# EAGLE design PracticalArduino_ProtoShield_v2_0_mega (EAGLE 5.06)
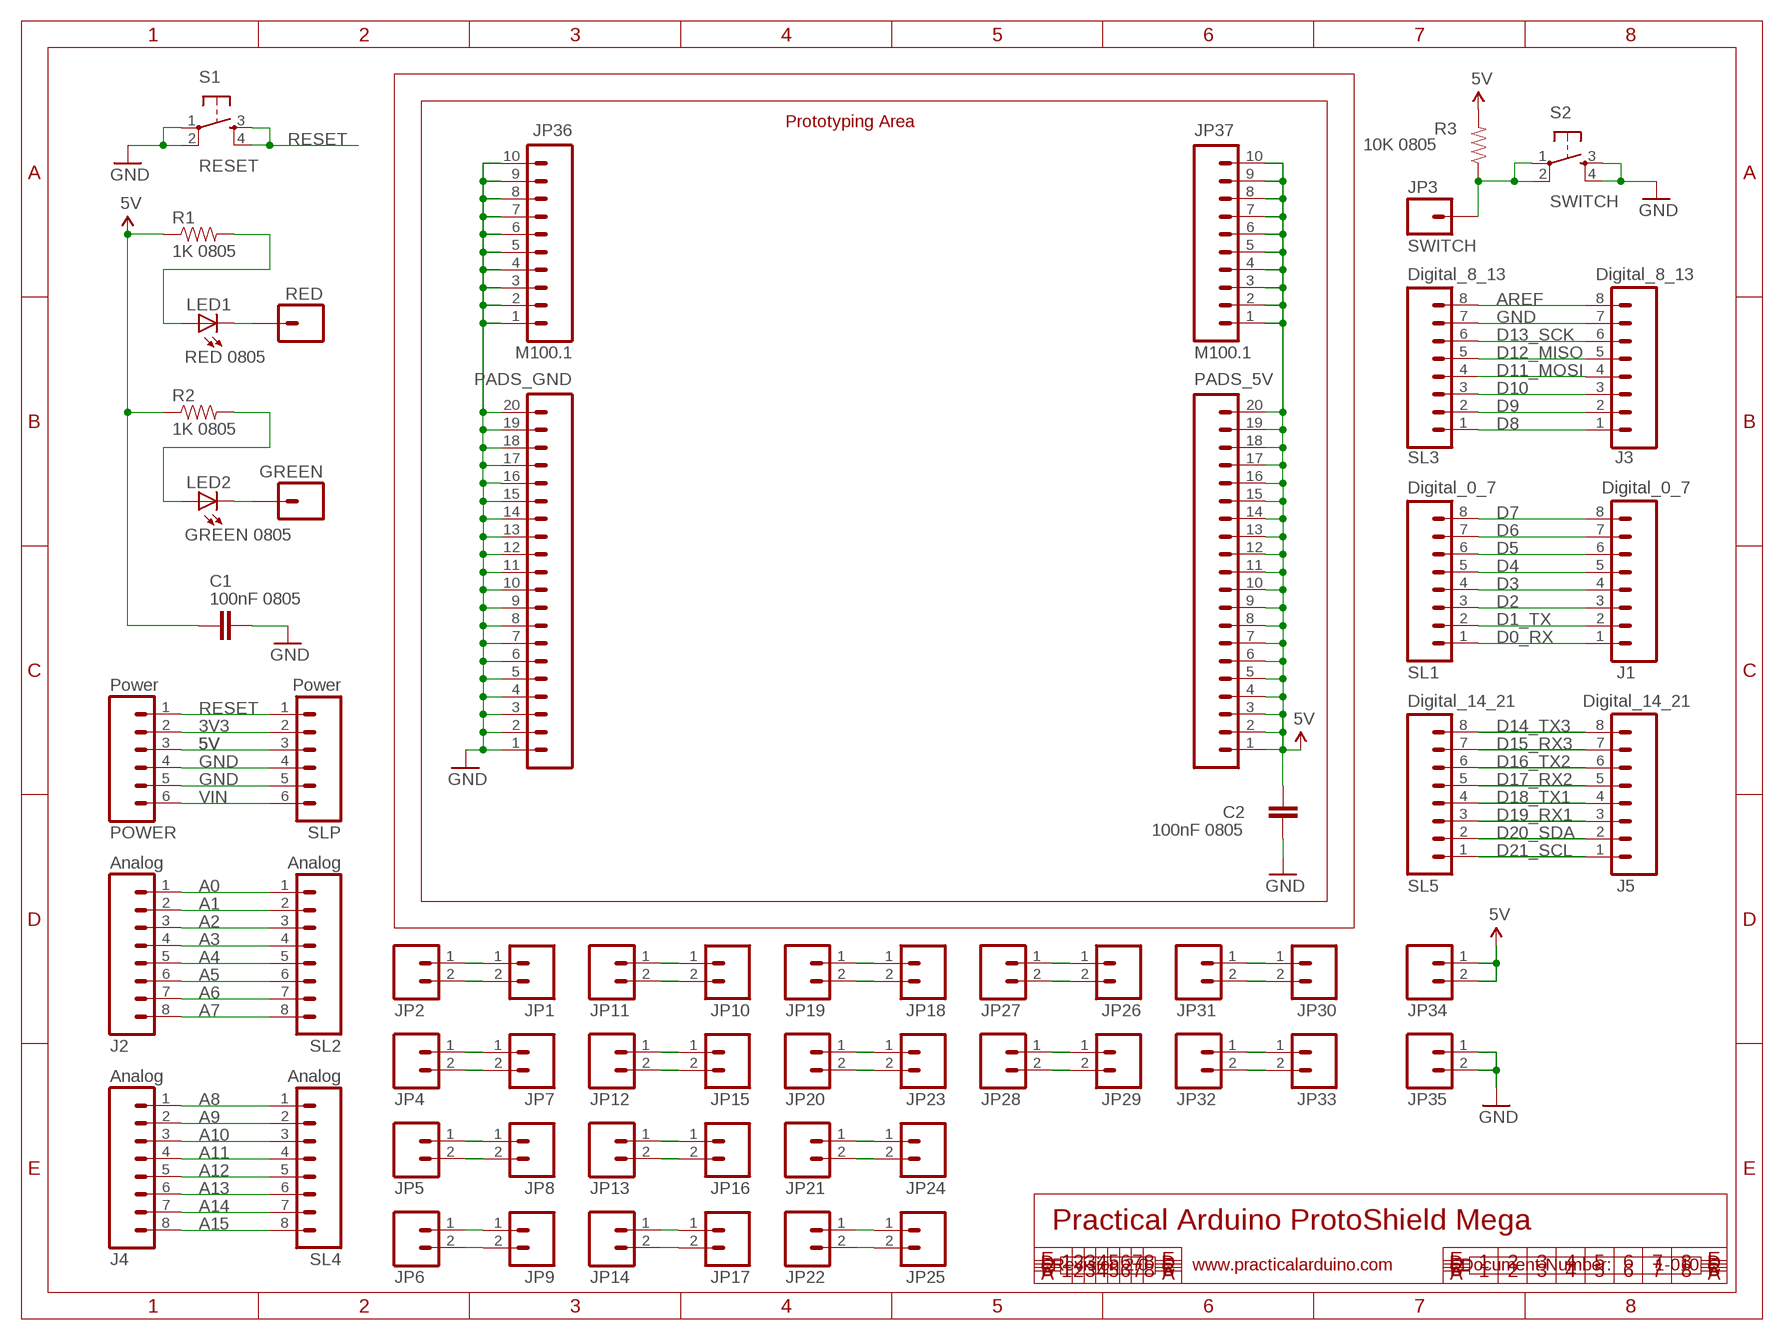
[diagram p0: schematic, sheet 1]

## Parts
C1  100nF 0805  CAP0805-LARGE  [0805-LARGE]
C2  100nF 0805  CAP0805-LARGE  [0805-LARGE]
GREEN  M01PTH  [1X01]
J1  Digital_0_7  M08  [1X08]
J2  Analog  M08  [1X08]
J3  Digital_8_13  M08  [1X08]
J4  Analog  M08  [1X08]
J5  Digital_14_21  M08  [1X08]
JP1  M02PTH  [1X02]
JP2  M02PTH  [1X02]
JP3  SWITCH  M01PTH  [1X01]
JP4  M02PTH  [1X02]
JP5  M02PTH  [1X02]
JP6  M02PTH  [1X02]
JP7  M02PTH  [1X02]
JP8  M02PTH  [1X02]
JP9  M02PTH  [1X02]
JP10  M02PTH  [1X02]
JP11  M02PTH  [1X02]
JP12  M02PTH  [1X02]
JP13  M02PTH  [1X02]
JP14  M02PTH  [1X02]
JP15  M02PTH  [1X02]
JP16  M02PTH  [1X02]
JP17  M02PTH  [1X02]
JP18  M02PTH  [1X02]
JP19  M02PTH  [1X02]
JP20  M02PTH  [1X02]
JP21  M02PTH  [1X02]
JP22  M02PTH  [1X02]
JP23  M02PTH  [1X02]
JP24  M02PTH  [1X02]
JP25  M02PTH  [1X02]
JP26  M02PTH  [1X02]
JP27  M02PTH  [1X02]
JP28  M02PTH  [1X02]
JP29  M02PTH  [1X02]
JP30  M02PTH  [1X02]
JP31  M02PTH  [1X02]
JP32  M02PTH  [1X02]
JP33  M02PTH  [1X02]
JP34  M02PTH  [1X02]
JP35  M02PTH  [1X02]
JP36  M100.1  [1X10]
JP37  M100.1  [1X10]
LED1  RED 0805  LED0805-LARGE  [LED-0805-LARGE]
LED2  GREEN 0805  LED0805-LARGE  [LED-0805-LARGE]
PADS_5V  M20  [1X20]
PADS_GND  M20  [1X20]
POWER  Power  M06SIP  [1X06]
R1  1K 0805  RESISTOR0805-LARGE  [0805-LARGE]
R2  1K 0805  RESISTOR0805-LARGE  [0805-LARGE]
R3  10K 0805  RESISTOR0805-LARGE  [0805-LARGE]
RED  M01PTH  [1X01]
S1  RESET  TAC_SWITCHPTH  [TACTILE-PTH]
S2  SWITCH  TAC_SWITCHPTH  [TACTILE-PTH]
SL1  Digital_0_7  M08  [1X08]
SL2  Analog  M08  [1X08]
SL3  Digital_8_13  M08  [1X08]
SL4  Analog  M08  [1X08]
SL5  Digital_14_21  M08  [1X08]
SLP  Power  M06SIP  [1X06]

## Nets
3V3: POWER.2 SLP.2
5V: C1.1 C2.1 JP34.1 JP34.2 JP37.1 JP37.2 JP37.3 JP37.4 JP37.5 JP37.6 JP37.7 JP37.8 JP37.9 JP37.10 PADS_5V.1 PADS_5V.2 PADS_5V.3 PADS_5V.4 PADS_5V.5 PADS_5V.6 PADS_5V.7 PADS_5V.8 PADS_5V.9 PADS_5V.10 PADS_5V.11 PADS_5V.12 PADS_5V.13 PADS_5V.14 PADS_5V.15 PADS_5V.16 PADS_5V.17 PADS_5V.18 PADS_5V.19 PADS_5V.20 POWER.3 R1.1 R2.1 R3.2 SLP.3
A0: J2.1 SL2.1
A1: J2.2 SL2.2
A2: J2.3 SL2.3
A3: J2.4 SL2.4
A4: J2.5 SL2.5
A5: J2.6 SL2.6
A6: J2.7 SL2.7
A7: J2.8 SL2.8
A8: J4.1 SL4.1
A9: J4.2 SL4.2
A10: J4.3 SL4.3
A11: J4.4 SL4.4
A12: J4.5 SL4.5
A13: J4.6 SL4.6
A14: J4.7 SL4.7
A15: J4.8 SL4.8
AREF: J3.8 SL3.8
D0_RX: J1.1 SL1.1
D1: JP10.2 JP11.2
D1_TX: J1.2 SL1.2
D2: J1.3 SL1.3
D3: J1.4 SL1.4
D4: J1.5 SL1.5
D5: J1.6 SL1.6
D6: J1.7 SL1.7
D7: J1.8 SL1.8
D8: J3.1 SL3.1
D9: J3.2 SL3.2
D10: J3.3 SL3.3
D11: JP10.1 JP11.1
D11_MOSI: J3.4 SL3.4
D12: JP18.2 JP19.2
D12_MISO: J3.5 SL3.5
D13: JP18.1 JP19.1
D13_SCK: J3.6 SL3.6
D14: JP26.2 JP27.2
D14_TX3: J5.8 SL5.8
D15: JP26.1 JP27.1
D15_RX3: J5.7 SL5.7
D16: JP30.2 JP31.2
D16_TX2: J5.6 SL5.6
D17: JP30.1 JP31.1
D17_RX2: J5.5 SL5.5
D18_TX1: J5.4 SL5.4
D19_RX1: J5.3 SL5.3
D20_SDA: J5.2 SL5.2
D21_SCL: J5.1 SL5.1
D22: JP1.2 JP2.2
D23: JP1.1 JP2.1
GND: C1.2 C2.2 J3.7 JP35.1 JP35.2 JP36.1 JP36.2 JP36.3 JP36.4 JP36.5 JP36.6 JP36.7 JP36.8 JP36.9 JP36.10 PADS_GND.1 PADS_GND.2 PADS_GND.3 PADS_GND.4 PADS_GND.5 PADS_GND.6 PADS_GND.7 PADS_GND.8 PADS_GND.9 PADS_GND.10 PADS_GND.11 PADS_GND.12 PADS_GND.13 PADS_GND.14 PADS_GND.15 PADS_GND.16 PADS_GND.17 PADS_GND.18 PADS_GND.19 PADS_GND.20 POWER.4 POWER.5 S1.1 S1.2 S2.3 S2.4 SL3.7 SLP.4 SLP.5
N$1: LED1.A R1.2
N$2: LED1.C RED.1
N$3: LED2.A R2.2
N$4: GREEN.1 LED2.C
N$6: JP3.1 R3.1 S2.1 S2.2
N$337: JP4.1 JP7.1
N$338: JP4.2 JP7.2
N$339: JP5.1 JP8.1
N$340: JP5.2 JP8.2
N$341: JP6.1 JP9.1
N$342: JP6.2 JP9.2
N$343: JP12.1 JP15.1
N$344: JP12.2 JP15.2
N$345: JP13.1 JP16.1
N$346: JP13.2 JP16.2
N$347: JP14.1 JP17.1
N$348: JP14.2 JP17.2
N$349: JP20.1 JP23.1
N$350: JP20.2 JP23.2
N$351: JP21.1 JP24.1
N$352: JP21.2 JP24.2
N$353: JP22.1 JP25.1
N$354: JP22.2 JP25.2
N$355: JP28.1 JP29.1
N$356: JP28.2 JP29.2
N$357: JP32.1 JP33.1
N$358: JP32.2 JP33.2
RESET: POWER.1 S1.3 S1.4 SLP.1
VIN: POWER.6 SLP.6

## Notes on the sheet
- Prototyping Area
- Practical Arduino ProtoShield Mega
- Revision 2.0 | www.practicalarduino.com | Document Number: | 1-010

## Library data of the parts
C1 C2 = SparkFun:CAP: Capacitor Standard 0603 ceramic capacitor, and 0.1" leaded capacitor.
GREEN JP3 RED = SparkFun:M01: Header 1 Standard 1-pin 0.1" header. Use with straight break away headers (SKU : PRT-00116), right angle break away headers (PRT-00553), swiss pins (PRT-00743), machine pins (PRT-00117), and female headers (PRT-00115).
J1-J5 SL1-SL5 = SparkFun:M08: Header 8 Standard 8-pin 0.1" header. Use with straight break away headers (SKU : PRT-00116), right angle break away headers (PRT-00553), swiss pins (PRT-00743), machine pins (PRT-00117), and female headers (PRT-00115).
JP1 JP2 JP4-JP35 = SparkFun:M02: Header 2 Standard 2-pin 0.1" header. Use with straight break away headers (SKU : PRT-00116), right angle break away headers (PRT-00553), swiss pins (PRT-00743), machine pins (PRT-00117), and female headers (PRT-00115). Molex polarized connector foot print use with SKU : PRT-08233 with associated crimp pins and housings.
JP36 JP37 = SparkFun:M10: Header 10 Standard 10-pin 0.1" header. Use with straight break away headers (SKU : PRT-00116), right angle break away headers (PRT-00553), swiss pins (PRT-00743), machine pins (PRT-00117), and female headers (PRT-00115).
LED1 LED2 = SparkFun:LED: LEDs Standard schematic elements and footprints for 5mm, 3mm, 1206, and 0603 sized LEDs. 5mm - Spark Fun Electronics SKU : COM-00529 (and others)
PADS_5V PADS_GND = SparkFun:M20: This is just like the LOCK variant in that the holes are staggared by 5 mil, but except for the last two holes. They are not altered from the "standard" footprint layout. This is used for a special purpose on the layout of our Graphic LCD Backpack. Make sure you want to use this device before selecting it for you project!
POWER SLP = SparkFun:M06: Header 6 Standard 6-pin 0.1" header. Use with straight break away headers (SKU : PRT-00116), right angle break away headers (PRT-00553), swiss pins (PRT-00743), machine pins (PRT-00117), and female headers (PRT-00115). Molex polarized connector foot print use with SKU : PRT-08094 with associated crimp pins and housings. NOTES ON THE VARIANTS LOCK and LOCK_LONGPADS... This footprint was designed to help hold the alignment of a through-hole component (i.e. 6-pin header) while soldering it into place. You may notice that each hole has been shifted either up or down by 0.005 of an inch from it's more standard position (which is a perfectly straight line). This slight alteration caused the pins (the squares in the middle) to touch the edges of the holes. Because they are alternating, it causes a "brace" to hold the component in place. 0.005 has proven to be the perfect amount of "off-center" position when using our standard breakaway headers. Although looks a little odd when you look at the bare footprint, once you have a header in there, the alteration is very hard to notice. Also, if you push a header all the way into place, it is covered up entirely on the bottom side. This idea of altering the position of holes to aid alignment will be further integrated into the Sparkfun Library for other footprints. It can help hold any component with 3 or more connection pins.
R1-R3 = SparkFun:RESISTOR: Resistor Basic schematic elements and footprints for 0603, 1206, and PTH 1/10th watt (small) resistors.
S1 S2 = SparkFun:TAC_SWITCH: Momentary Switch Button commonly used for reset or general input. Spark Fun Electronics SKU : COM-00097

## Board
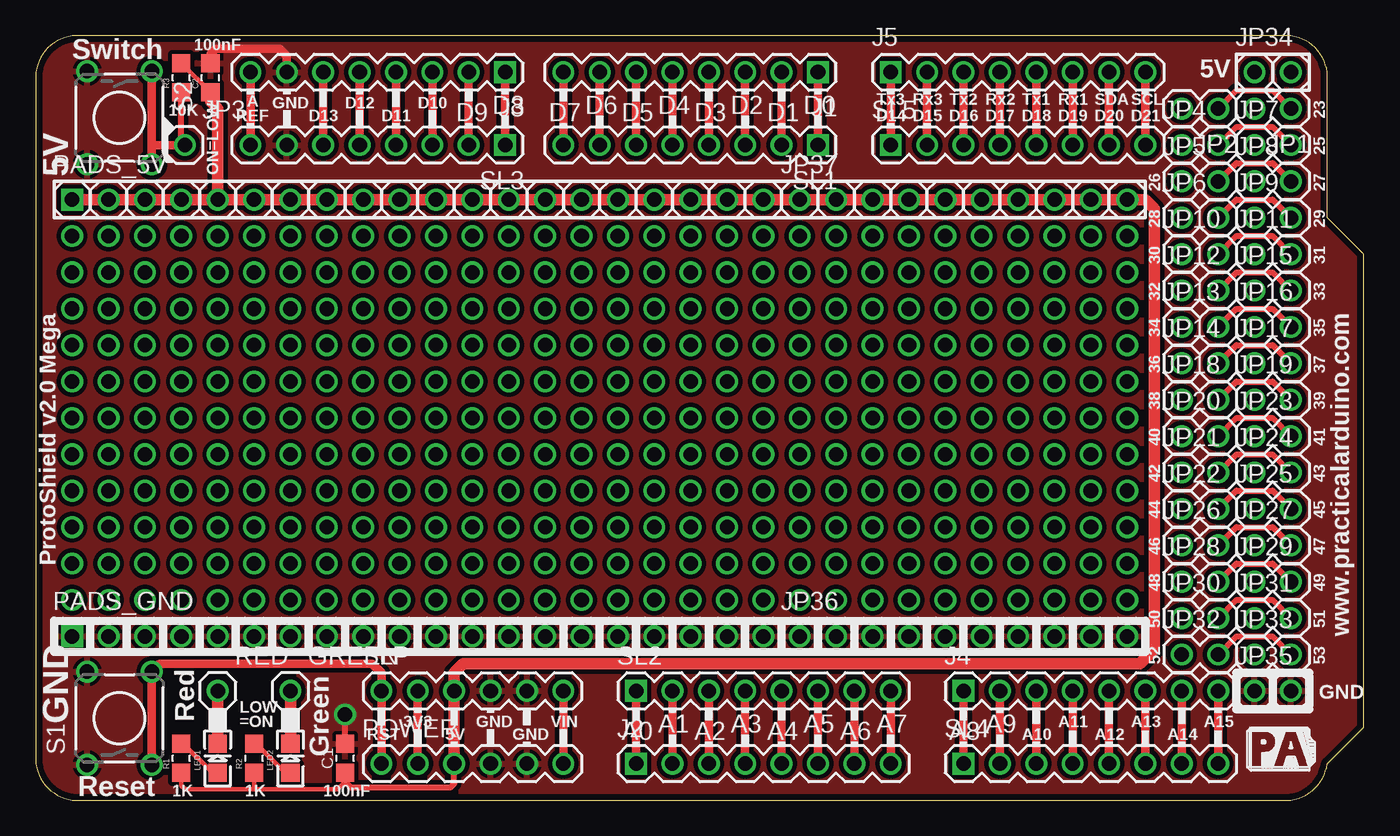
[diagram p1: board, top side]
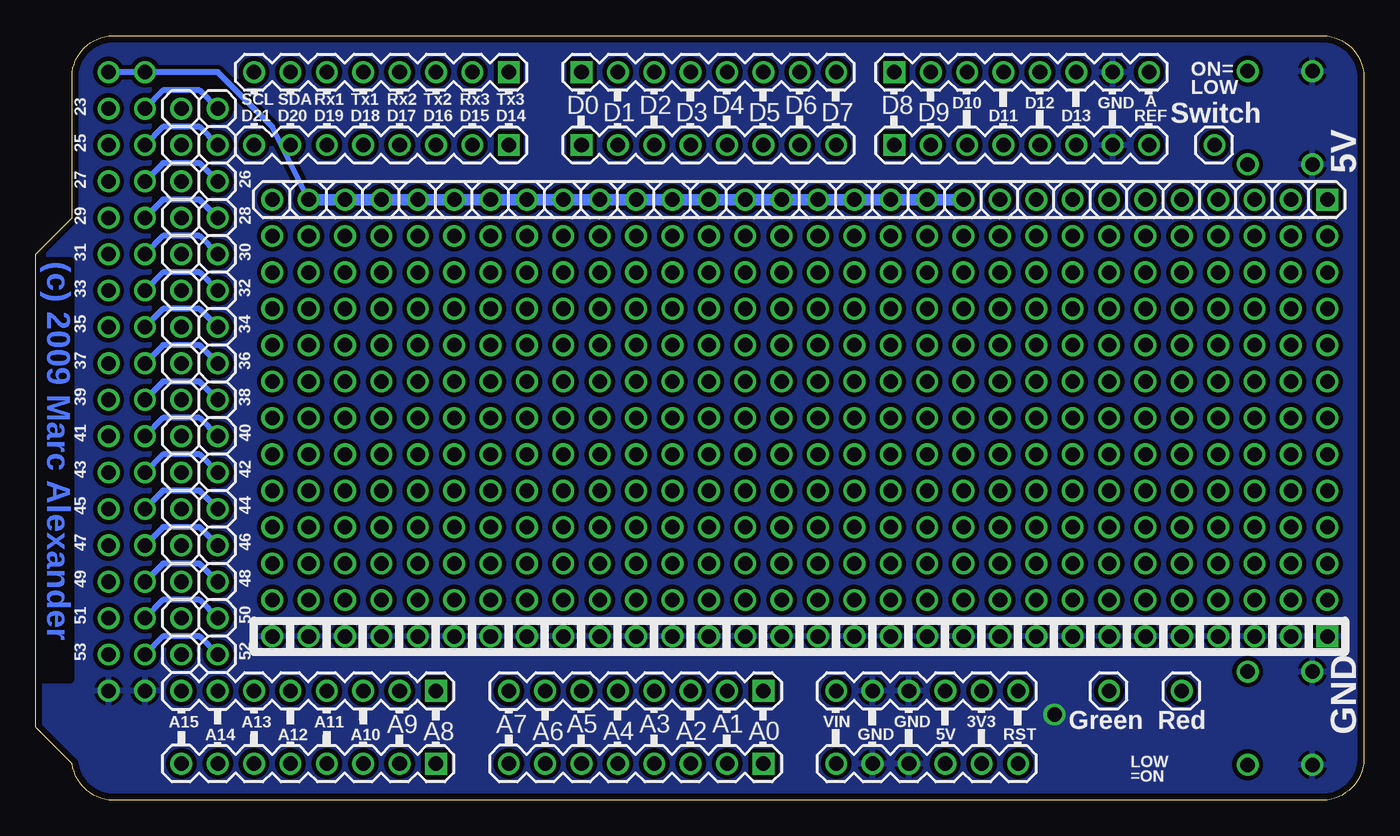
[diagram p2: board, bottom side, seen from below]

Size 92.71 x 53.34 mm. Coordinates in mm from the lower left corner, seen from the top.
Outline: 2.54,0 arc-74 0,2.54 0,50.8 arc-74 2.54,53.34 87.63,53.34 arc-74 90.17,50.8 90.17,40.64 92.71,38.1 92.71,5.08 90.17,2.54 arc-74 87.63,0
Outline: 2.54,0 87.63,0
Outline: 2.54,0 87.63,0
Copper layers (1*16): Top 0.035mm / dielectric 1.5mm / Bottom 0.035mm
Design rules "default *": minimum track width 10mil, minimum drill 24mil, track to track 12mil, track to pad 12mil, pad to pad 12mil, via to via 12mil, smd to smd 8mil, copper to edge 18mil, drill to drill 8mil, minimum pad ring 10mil, minimum via ring 8mil, stop-mask expansion 4mil, vias tented up to drill 0mil, thermal gap 10mil

### Footprints (pad centres in the part's own frame; a part is rotated, then mirrored left to right if it is on the bottom)
0805-LARGE = smd 1.27 x 1.27: 1 -1.016,0; 2 1.016,0
1X01 = drill 1.016 round: 1 0,0
1X08 = drill 1.016 square: 1 0,0 | drill 1.016 round: 2 2.54,0; 3 5.08,0; 4 7.62,0; 5 10.16,0; 6 12.7,0; 7 15.24,0; 8 17.78,0
1X02 = drill 1.016 round: 1 0,0; 2 2.54,0
1X10 = drill 1.016 round: 1 0,0; 2 2.54,0; 3 5.08,0; 4 7.62,0; 5 10.16,0; 6 12.7,0; 7 15.24,0; 8 17.78,0; 9 20.32,0; 10 22.86,0
LED-0805-LARGE = smd 1.27 x 1.27: A -1.016,0; C 1.016,0
1X20 = drill 1.016 square: 1 0,0 | drill 1.016 round: 2 2.54,0; 3 5.08,0; 4 7.62,0; 5 10.16,0; 6 12.7,0; 7 15.24,0; 8 17.78,0; 9 20.32,0; 10 22.86,0; 11 25.4,0; 12 27.94,0; 13 30.48,0; 14 33.02,0; 15 35.56,0; 16 38.1,0; 17 40.64,0; 18 43.18,0; 19 45.72,0; 20 48.26,0
1X06 = drill 1.016 round: 1 0,0; 2 2.54,0; 3 5.08,0; 4 7.62,0; 5 10.16,0; 6 12.7,0
TACTILE-PTH = drill 1.016 round: 1 -3.251,2.261; 2 3.251,2.261; 3 -3.251,-2.261; 4 3.251,-2.261

### Placement (x,y rotation side)
C1  21.59,2.92 90 top
C2  12.19,50.42 90 top
GREEN  17.78,7.62 0 top
J1  54.61,50.8 180 top
J2  41.91,2.54 0 top
J3  32.77,50.8 180 top
J4  64.77,7.62 0 top
J5  59.69,50.8 0 top
JP1  87.63,48.26 180 top
JP2  82.55,48.26 180 top
JP3  10.41,45.72 0 top
JP4  80.01,45.72 0 top
JP5  80.01,43.18 0 top
JP6  80.01,40.64 0 top
JP7  85.09,45.72 0 top
JP8  85.09,43.18 0 top
JP9  85.09,40.64 0 top
JP10  80.01,38.1 0 top
JP11  85.09,38.1 0 top
JP12  80.01,35.56 0 top
JP13  80.01,33.02 0 top
JP14  80.01,30.48 0 top
JP15  85.09,35.56 0 top
JP16  85.09,33.02 0 top
JP17  85.09,30.48 0 top
JP18  80.01,27.94 0 top
JP19  85.09,27.94 0 top
JP20  80.01,25.4 0 top
JP21  80.01,22.86 0 top
JP22  80.01,20.32 0 top
JP23  85.09,25.4 0 top
JP24  85.09,22.86 0 top
JP25  85.09,20.32 0 top
JP26  80.01,17.78 0 top
JP27  85.09,17.78 0 top
JP28  80.01,15.24 0 top
JP29  85.09,15.24 0 top
JP30  80.01,12.7 0 top
JP31  85.09,12.7 0 top
JP32  80.01,10.16 0 top
JP33  85.09,10.16 0 top
JP34  85.09,50.8 0 top
JP35  85.09,7.62 0 top
JP36  53.34,11.43 0 top
JP37  53.34,41.91 0 top
LED1  12.7,2.92 90 top
LED2  17.78,2.92 90 top
PADS_5V  2.54,41.91 0 top
PADS_GND  2.54,11.43 0 top
POWER  24.13,2.54 0 top
R1  10.16,2.92 90 top
R2  15.24,2.92 90 top
R3  10.16,50.42 90 top
RED  12.7,7.62 0 top
S1  5.84,5.71 90 top
S2  5.84,47.62 270 top
SL1  54.61,45.72 180 top
SL2  41.91,7.62 0 top
SL3  32.77,45.72 180 top
SL4  64.77,2.54 0 top
SL5  59.69,45.72 0 top
SLP  24.13,7.62 0 top
U$4  [PRACTICALARDUINO-LOGO]  84.58,2.03 0 top

### Tracks (layer width: path | path; a pad name or v marks a point on that pad's centre or on a via)
3V3
  Top 0.61: POWER.2 SLP.2
5V
  Top 0.305: 21.59,1.27 21.08,0.76 15.11,0.76 | C2.1 R3.2 | 15.11,0.76 10.41,0.76 10.16,1.02 R1.1 | R2.1 15.24,0.89 15.11,0.76
  Top 0.406: POWER.3 29.21,1.14 28.96,0.89 21.97,0.89 21.59,1.27 C1.1
  Top 0.813: POWER.3 SLP.3 29.21,8.89 29.84,9.53 77.09,9.53 78.11,10.54 78.11,41.27 77.47,41.91 JP37.10 JP37.9 JP37.8 JP37.7 JP37.6 JP37.5 JP37.4 JP37.3 JP37.2 JP37.1 PADS_5V.20 PADS_5V.19 PADS_5V.18 PADS_5V.17 PADS_5V.16 PADS_5V.15 PADS_5V.14 PADS_5V.13 PADS_5V.12 PADS_5V.11 PADS_5V.10 PADS_5V.9 PADS_5V.8 PADS_5V.7 PADS_5V.6 PADS_5V.5 | C2.1 12.19,48.77 12.7,48.26 PADS_5V.5 | PADS_5V.1 PADS_5V.2 PADS_5V.3 PADS_5V.4 PADS_5V.5
  Bottom 0.406: JP34.2 JP34.1 80.01,50.8 76.2,46.99 JP37.9
  Bottom 0.813: PADS_5V.11 PADS_5V.18 JP37.9
A0
  Top 0.61: J2.1 SL2.1
A1
  Top 0.61: J2.2 SL2.2
A2
  Top 0.61: J2.3 SL2.3
A3
  Top 0.61: J2.4 SL2.4
A4
  Top 0.61: J2.5 SL2.5
A5
  Top 0.61: J2.6 SL2.6
A6
  Top 0.61: J2.7 SL2.7
A7
  Top 0.61: J2.8 SL2.8
A8
  Top 0.61: SL4.1 J4.1
A9
  Top 0.61: SL4.2 J4.2
A10
  Top 0.61: SL4.3 J4.3
A11
  Top 0.61: SL4.4 J4.4
A12
  Top 0.61: SL4.5 J4.5
A13
  Top 0.61: SL4.6 J4.6
A14
  Top 0.61: SL4.7 J4.7
A15
  Top 0.61: SL4.8 J4.8
AREF
  Top 0.61: SL3.8 J3.8
D0_RX
  Top 0.61: SL1.1 J1.1
D1
  Top 0.406: JP10.2 83.82,39.37 86.36,39.37 JP11.2
D1_TX
  Top 0.61: SL1.2 J1.2
D2
  Top 0.61: SL1.3 J1.3
D3
  Top 0.61: SL1.4 J1.4
D4
  Top 0.61: SL1.5 J1.5
D5
  Top 0.61: SL1.6 J1.6
D6
  Top 0.61: SL1.7 J1.7
D7
  Top 0.61: SL1.8 J1.8
D8
  Top 0.61: SL3.1 J3.1
D9
  Top 0.61: SL3.2 J3.2
D10
  Top 0.61: SL3.3 J3.3
D11
  Bottom 0.406: JP10.1 81.28,39.37 83.82,39.37 JP11.1
D11_MOSI
  Top 0.61: SL3.4 J3.4
D12
  Top 0.406: JP19.2 86.36,29.21 83.82,29.21 JP18.2
D12_MISO
  Top 0.61: SL3.5 J3.5
D13
  Bottom 0.406: JP18.1 81.28,29.21 83.82,29.21 JP19.1
D13_SCK
  Top 0.61: SL3.6 J3.6
D14
  Top 0.406: JP27.2 86.36,19.05 83.82,19.05 JP26.2
D14_TX3
  Top 0.61: SL5.8 J5.8
D15
  Bottom 0.406: JP26.1 81.28,19.05 83.82,19.05 JP27.1
D15_RX3
  Top 0.61: SL5.7 J5.7
D16
  Top 0.406: JP31.2 86.36,13.97 83.82,13.97 JP30.2
D16_TX2
  Top 0.61: SL5.6 J5.6
D17
  Bottom 0.406: JP30.1 81.28,13.97 83.82,13.97 JP31.1
D17_RX2
  Top 0.61: SL5.5 J5.5
D18_TX1
  Top 0.61: SL5.4 J5.4
D19_RX1
  Top 0.61: SL5.3 J5.3
D20_SDA
  Top 0.61: SL5.2 J5.2
D21_SCL
  Top 0.61: SL5.1 J5.1
D22
  Bottom 0.406: JP2.2 81.28,49.53 83.82,49.53 JP1.2
D23
  Top 0.406: JP1.1 86.36,49.53 83.82,49.53 JP2.1
GND  (via drill 1.02)
  Top 0.406: C1.2 v21.59,5.97
  Top 0.508: C2.2 12.2,52.08
  Top 0.61: 12.2,52.08 12.57,52.45 17.02,52.45 17.53,51.94 J3.7
  pour Bottom: 0,50.8 arc-74 2.54,53.34 87.63,53.34 arc-74 90.17,50.8 90.17,40.64 92.71,38.1 92.71,5.08 90.17,2.54 arc-74 87.63,0 2.54,0 arc-90 0,2.54
  pour Top: 0,50.8 arc-74 2.54,53.34 87.63,53.34 arc-74 90.17,50.8 90.17,40.64 92.71,38.1 92.71,5.08 90.17,2.54 arc-74 87.63,0 2.54,0 arc-74 0,2.54
N$1
  Top 0.305: R1.2 10.29,3.94 12.19,2.03 12.57,2.03 LED1.A
N$2
  Top 0.813: LED1.C RED.1
N$3
  Top 0.305: R2.2 15.37,3.94 17.27,2.03 17.65,2.03 LED2.A
N$4
  Top 0.813: LED2.C GREEN.1
N$5  (via drill 1.02)
  other vias: 50.8,13.97
N$6
  Top 0.406: 10.16,45.72 R3.1
  Top 0.61: S2.2 8.1,45.72 | 8.1,45.72 S2.1 | 8.1,45.72 10.16,45.72 JP3.1
N$7  (via drill 1.02)
  other vias: 48.26,13.97
N$8  (via drill 1.02)
  other vias: 45.72,13.97
N$9  (via drill 1.02)
  other vias: 43.18,13.97
N$10  (via drill 1.02)
  other vias: 40.64,13.97
N$11  (via drill 1.02)
  other vias: 38.1,13.97
N$12  (via drill 1.02)
  other vias: 35.56,13.97
N$13  (via drill 1.02)
  other vias: 33.02,13.97
N$14  (via drill 1.02)
  other vias: 30.48,13.97
N$15  (via drill 1.02)
  other vias: 27.94,13.97
N$16  (via drill 1.02)
  other vias: 25.4,13.97
N$17  (via drill 1.02)
  other vias: 22.86,13.97
N$18  (via drill 1.02)
  other vias: 20.32,13.97
N$19  (via drill 1.02)
  other vias: 17.78,13.97
N$20  (via drill 1.02)
  other vias: 15.24,13.97
N$21  (via drill 1.02)
  other vias: 12.7,13.97
N$22  (via drill 1.02)
  other vias: 50.8,16.51
N$23  (via drill 1.02)
  other vias: 48.26,16.51
N$24  (via drill 1.02)
  other vias: 45.72,16.51
N$25  (via drill 1.02)
  other vias: 43.18,16.51
N$26  (via drill 1.02)
  other vias: 40.64,16.51
N$27  (via drill 1.02)
  other vias: 38.1,16.51
N$28  (via drill 1.02)
  other vias: 35.56,16.51
N$29  (via drill 1.02)
  other vias: 33.02,16.51
N$30  (via drill 1.02)
  other vias: 30.48,16.51
N$31  (via drill 1.02)
  other vias: 27.94,16.51
N$32  (via drill 1.02)
  other vias: 25.4,16.51
N$33  (via drill 1.02)
  other vias: 22.86,16.51
N$34  (via drill 1.02)
  other vias: 20.32,16.51
N$35  (via drill 1.02)
  other vias: 17.78,16.51
N$36  (via drill 1.02)
  other vias: 15.24,16.51
N$37  (via drill 1.02)
  other vias: 12.7,16.51
N$38  (via drill 1.02)
  other vias: 50.8,19.05
N$39  (via drill 1.02)
  other vias: 48.26,19.05
N$40  (via drill 1.02)
  other vias: 45.72,19.05
N$41  (via drill 1.02)
  other vias: 43.18,19.05
N$42  (via drill 1.02)
  other vias: 40.64,19.05
N$43  (via drill 1.02)
  other vias: 38.1,19.05
N$44  (via drill 1.02)
  other vias: 35.56,19.05
N$45  (via drill 1.02)
  other vias: 33.02,19.05
N$46  (via drill 1.02)
  other vias: 30.48,19.05
N$47  (via drill 1.02)
  other vias: 27.94,19.05
N$48  (via drill 1.02)
  other vias: 25.4,19.05
N$49  (via drill 1.02)
  other vias: 22.86,19.05
N$50  (via drill 1.02)
  other vias: 20.32,19.05
N$51  (via drill 1.02)
  other vias: 17.78,19.05
N$52  (via drill 1.02)
  other vias: 15.24,19.05
N$53  (via drill 1.02)
  other vias: 12.7,19.05
N$54  (via drill 1.02)
  other vias: 50.8,21.59
N$55  (via drill 1.02)
  other vias: 48.26,21.59
N$56  (via drill 1.02)
  other vias: 45.72,21.59
N$57  (via drill 1.02)
  other vias: 43.18,21.59
N$58  (via drill 1.02)
  other vias: 40.64,21.59
N$59  (via drill 1.02)
  other vias: 38.1,21.59
N$60  (via drill 1.02)
  other vias: 35.56,21.59
N$61  (via drill 1.02)
  other vias: 33.02,21.59
N$62  (via drill 1.02)
  other vias: 30.48,21.59
N$63  (via drill 1.02)
  other vias: 27.94,21.59
N$64  (via drill 1.02)
  other vias: 25.4,21.59
N$65  (via drill 1.02)
  other vias: 22.86,21.59
N$66  (via drill 1.02)
  other vias: 20.32,21.59
N$67  (via drill 1.02)
  other vias: 17.78,21.59
N$68  (via drill 1.02)
  other vias: 15.24,21.59
N$69  (via drill 1.02)
  other vias: 12.7,21.59
N$70  (via drill 1.02)
  other vias: 50.8,24.13
N$71  (via drill 1.02)
  other vias: 48.26,24.13
N$72  (via drill 1.02)
  other vias: 45.72,24.13
N$73  (via drill 1.02)
  other vias: 43.18,24.13
N$74  (via drill 1.02)
  other vias: 40.64,24.13
N$75  (via drill 1.02)
  other vias: 38.1,24.13
N$76  (via drill 1.02)
  other vias: 35.56,24.13
N$77  (via drill 1.02)
  other vias: 33.02,24.13
N$78  (via drill 1.02)
  other vias: 30.48,24.13
N$79  (via drill 1.02)
  other vias: 27.94,24.13
N$80  (via drill 1.02)
  other vias: 25.4,24.13
N$81  (via drill 1.02)
  other vias: 22.86,24.13
N$82  (via drill 1.02)
  other vias: 20.32,24.13
N$83  (via drill 1.02)
  other vias: 17.78,24.13
N$84  (via drill 1.02)
  other vias: 15.24,24.13
N$85  (via drill 1.02)
  other vias: 12.7,24.13
N$86  (via drill 1.02)
  other vias: 50.8,26.67
N$87  (via drill 1.02)
  other vias: 48.26,26.67
N$88  (via drill 1.02)
  other vias: 45.72,26.67
N$89  (via drill 1.02)
  other vias: 45.72,29.21
N$90  (via drill 1.02)
  other vias: 40.64,26.67
N$91  (via drill 1.02)
  other vias: 38.1,26.67
N$92  (via drill 1.02)
  other vias: 35.56,26.67
N$93  (via drill 1.02)
  other vias: 33.02,26.67
N$94  (via drill 1.02)
  other vias: 30.48,26.67
N$95  (via drill 1.02)
  other vias: 27.94,26.67
N$96  (via drill 1.02)
  other vias: 25.4,26.67
N$97  (via drill 1.02)
  other vias: 22.86,26.67
N$98  (via drill 1.02)
  other vias: 20.32,26.67
N$99  (via drill 1.02)
  other vias: 17.78,26.67
N$100  (via drill 1.02)
  other vias: 15.24,26.67
N$101  (via drill 1.02)
  other vias: 12.7,26.67
N$102  (via drill 1.02)
  other vias: 50.8,29.21
N$103  (via drill 1.02)
  other vias: 48.26,29.21
N$104  (via drill 1.02)
  other vias: 43.18,29.21
N$105  (via drill 1.02)
  other vias: 43.18,26.67
N$106  (via drill 1.02)
  other vias: 40.64,29.21
N$107  (via drill 1.02)
  other vias: 38.1,29.21
N$108  (via drill 1.02)
  other vias: 35.56,29.21
N$109  (via drill 1.02)
  other vias: 33.02,29.21
N$110  (via drill 1.02)
  other vias: 30.48,29.21
N$111  (via drill 1.02)
  other vias: 27.94,29.21
N$112  (via drill 1.02)
  other vias: 25.4,29.21
N$113  (via drill 1.02)
  other vias: 22.86,29.21
N$114  (via drill 1.02)
  other vias: 20.32,29.21
N$115  (via drill 1.02)
  other vias: 17.78,29.21
N$116  (via drill 1.02)
  other vias: 15.24,29.21
N$117  (via drill 1.02)
  other vias: 12.7,29.21
N$118  (via drill 1.02)
  other vias: 50.8,31.75
N$119  (via drill 1.02)
  other vias: 48.26,31.75
N$120  (via drill 1.02)
  other vias: 45.72,31.75
N$121  (via drill 1.02)
  other vias: 43.18,31.75
N$122  (via drill 1.02)
  other vias: 40.64,31.75
N$123  (via drill 1.02)
  other vias: 38.1,31.75
N$124  (via drill 1.02)
  other vias: 35.56,31.75
N$125  (via drill 1.02)
  other vias: 33.02,31.75
N$126  (via drill 1.02)
  other vias: 30.48,31.75
N$127  (via drill 1.02)
  other vias: 27.94,31.75
N$128  (via drill 1.02)
  other vias: 25.4,31.75
N$129  (via drill 1.02)
  other vias: 22.86,31.75
N$130  (via drill 1.02)
  other vias: 20.32,31.75
N$131  (via drill 1.02)
  other vias: 17.78,31.75
N$132  (via drill 1.02)
  other vias: 15.24,31.75
N$133  (via drill 1.02)
  other vias: 12.7,31.75
N$134  (via drill 1.02)
  other vias: 50.8,34.29
N$135  (via drill 1.02)
  other vias: 48.26,34.29
N$136  (via drill 1.02)
  other vias: 45.72,34.29
N$137  (via drill 1.02)
  other vias: 43.18,34.29
N$138  (via drill 1.02)
  other vias: 40.64,34.29
N$139  (via drill 1.02)
  other vias: 38.1,34.29
N$140  (via drill 1.02)
  other vias: 35.56,34.29
N$141  (via drill 1.02)
  other vias: 33.02,34.29
N$142  (via drill 1.02)
  other vias: 30.48,34.29
N$143  (via drill 1.02)
  other vias: 27.94,34.29
N$144  (via drill 1.02)
  other vias: 25.4,34.29
N$145  (via drill 1.02)
  other vias: 22.86,34.29
N$146  (via drill 1.02)
  other vias: 20.32,34.29
N$147  (via drill 1.02)
  other vias: 17.78,34.29
N$148  (via drill 1.02)
  other vias: 15.24,34.29
N$149  (via drill 1.02)
  other vias: 12.7,34.29
N$150  (via drill 1.02)
  other vias: 71.12,13.97
N$151  (via drill 1.02)
  other vias: 68.58,13.97
N$152  (via drill 1.02)
  other vias: 45.72,36.83
N$153  (via drill 1.02)
  other vias: 43.18,36.83
N$154  (via drill 1.02)
  other vias: 40.64,36.83
N$155  (via drill 1.02)
  other vias: 38.1,36.83
N$156  (via drill 1.02)
  other vias: 35.56,36.83
N$157  (via drill 1.02)
  other vias: 33.02,36.83
N$158  (via drill 1.02)
  other vias: 30.48,36.83
N$159  (via drill 1.02)
  other vias: 27.94,36.83
N$160  (via drill 1.02)
  other vias: 25.4,36.83
N$161  (via drill 1.02)
  other vias: 22.86,36.83
N$162  (via drill 1.02)
  other vias: 20.32,36.83
N$163  (via drill 1.02)
  other vias: 17.78,36.83
N$164  (via drill 1.02)
  other vias: 15.24,36.83
N$165  (via drill 1.02)
  other vias: 12.7,36.83
N$166  (via drill 1.02)
  other vias: 50.8,39.37
N$167  (via drill 1.02)
  other vias: 48.26,39.37
N$168  (via drill 1.02)
  other vias: 45.72,39.37
N$169  (via drill 1.02)
  other vias: 43.18,39.37
N$170  (via drill 1.02)
  other vias: 40.64,39.37
N$171  (via drill 1.02)
  other vias: 38.1,39.37
N$172  (via drill 1.02)
  other vias: 35.56,39.37
N$173  (via drill 1.02)
  other vias: 33.02,39.37
N$174  (via drill 1.02)
  other vias: 30.48,39.37
N$175  (via drill 1.02)
  other vias: 27.94,39.37
N$176  (via drill 1.02)
  other vias: 25.4,39.37
N$177  (via drill 1.02)
  other vias: 22.86,39.37
N$178  (via drill 1.02)
  other vias: 20.32,39.37
N$179  (via drill 1.02)
  other vias: 17.78,39.37
N$180  (via drill 1.02)
  other vias: 15.24,39.37
N$181  (via drill 1.02)
  other vias: 12.7,39.37
N$182  (via drill 1.02)
  other vias: 53.34,13.97
N$183  (via drill 1.02)
  other vias: 53.34,16.51
N$184  (via drill 1.02)
  other vias: 53.34,19.05
N$185  (via drill 1.02)
  other vias: 53.34,21.59
N$186  (via drill 1.02)
  other vias: 53.34,24.13
N$187  (via drill 1.02)
  other vias: 53.34,26.67
N$188  (via drill 1.02)
  other vias: 53.34,29.21
N$189  (via drill 1.02)
  other vias: 53.34,31.75
N$190  (via drill 1.02)
  other vias: 53.34,34.29
N$191  (via drill 1.02)
  other vias: 66.04,13.97
N$192  (via drill 1.02)
  other vias: 53.34,39.37
N$193  (via drill 1.02)
  other vias: 55.88,13.97
N$194  (via drill 1.02)
  other vias: 55.88,16.51
N$195  (via drill 1.02)
  other vias: 55.88,19.05
N$196  (via drill 1.02)
  other vias: 55.88,21.59
N$197  (via drill 1.02)
  other vias: 55.88,24.13
N$198  (via drill 1.02)
  other vias: 55.88,26.67
N$199  (via drill 1.02)
  other vias: 55.88,29.21
N$200  (via drill 1.02)
  other vias: 55.88,31.75
N$201  (via drill 1.02)
  other vias: 55.88,34.29
N$202  (via drill 1.02)
  other vias: 63.5,13.97
N$204  (via drill 1.02)
  other vias: 10.16,13.97
N$205  (via drill 1.02)
  other vias: 10.16,16.51
N$206  (via drill 1.02)
  other vias: 10.16,19.05
N$207  (via drill 1.02)
  other vias: 10.16,21.59
N$208  (via drill 1.02)
  other vias: 10.16,24.13
N$209  (via drill 1.02)
  other vias: 10.16,26.67
N$210  (via drill 1.02)
  other vias: 10.16,29.21
N$211  (via drill 1.02)
  other vias: 10.16,31.75
N$212  (via drill 1.02)
  other vias: 10.16,34.29
N$213  (via drill 1.02)
  other vias: 10.16,36.83
N$214  (via drill 1.02)
  other vias: 10.16,39.37
N$215  (via drill 1.02)
  other vias: 7.62,13.97
N$216  (via drill 1.02)
  other vias: 7.62,16.51
N$217  (via drill 1.02)
  other vias: 7.62,19.05
N$218  (via drill 1.02)
  other vias: 7.62,21.59
N$219  (via drill 1.02)
  other vias: 7.62,24.13
N$220  (via drill 1.02)
  other vias: 7.62,26.67
N$221  (via drill 1.02)
  other vias: 7.62,29.21
N$222  (via drill 1.02)
  other vias: 7.62,31.75
N$223  (via drill 1.02)
  other vias: 7.62,34.29
N$224  (via drill 1.02)
  other vias: 7.62,36.83
N$225  (via drill 1.02)
  other vias: 7.62,39.37
N$226  (via drill 1.02)
  other vias: 5.08,13.97
N$227  (via drill 1.02)
  other vias: 5.08,16.51
N$228  (via drill 1.02)
  other vias: 5.08,19.05
N$229  (via drill 1.02)
  other vias: 5.08,21.59
N$230  (via drill 1.02)
  other vias: 5.08,24.13
N$231  (via drill 1.02)
  other vias: 5.08,26.67
N$232  (via drill 1.02)
  other vias: 5.08,29.21
N$233  (via drill 1.02)
  other vias: 5.08,31.75
N$234  (via drill 1.02)
  other vias: 5.08,34.29
N$235  (via drill 1.02)
  other vias: 5.08,36.83
N$236  (via drill 1.02)
  other vias: 5.08,39.37
N$237  (via drill 1.02)
  other vias: 2.54,13.97
N$238  (via drill 1.02)
  other vias: 2.54,16.51
N$239  (via drill 1.02)
  other vias: 2.54,19.05
N$240  (via drill 1.02)
  other vias: 2.54,21.59
N$241  (via drill 1.02)
  other vias: 2.54,24.13
N$242  (via drill 1.02)
  other vias: 2.54,26.67
N$243  (via drill 1.02)
  other vias: 2.54,29.21
N$244  (via drill 1.02)
  other vias: 2.54,31.75
N$245  (via drill 1.02)
  other vias: 2.54,34.29
N$246  (via drill 1.02)
  other vias: 2.54,36.83
N$247  (via drill 1.02)
  other vias: 2.54,39.37
N$248  (via drill 1.02)
  other vias: 60.96,13.97
N$249  (via drill 1.02)
  other vias: 58.42,13.97
N$250  (via drill 1.02)
  other vias: 71.12,16.51
N$251  (via drill 1.02)
  other vias: 68.58,16.51
N$252  (via drill 1.02)
  other vias: 66.04,16.51
N$253  (via drill 1.02)
  other vias: 63.5,16.51
N$254  (via drill 1.02)
  other vias: 60.96,16.51
N$255  (via drill 1.02)
  other vias: 58.42,16.51
N$256  (via drill 1.02)
  other vias: 71.12,19.05
N$257  (via drill 1.02)
  other vias: 68.58,19.05
N$258  (via drill 1.02)
  other vias: 66.04,19.05
N$259  (via drill 1.02)
  other vias: 63.5,19.05
N$260  (via drill 1.02)
  other vias: 60.96,19.05
N$261  (via drill 1.02)
  other vias: 58.42,19.05
N$262  (via drill 1.02)
  other vias: 71.12,21.59
N$263  (via drill 1.02)
  other vias: 68.58,21.59
N$264  (via drill 1.02)
  other vias: 66.04,21.59
N$265  (via drill 1.02)
  other vias: 63.5,21.59
N$266  (via drill 1.02)
  other vias: 60.96,21.59
N$267  (via drill 1.02)
  other vias: 58.42,21.59
N$268  (via drill 1.02)
  other vias: 71.12,24.13
N$269  (via drill 1.02)
  other vias: 68.58,24.13
N$270  (via drill 1.02)
  other vias: 66.04,24.13
N$271  (via drill 1.02)
  other vias: 63.5,24.13
N$272  (via drill 1.02)
  other vias: 60.96,24.13
N$273  (via drill 1.02)
  other vias: 58.42,24.13
N$274  (via drill 1.02)
  other vias: 71.12,26.67
N$275  (via drill 1.02)
  other vias: 68.58,26.67
N$276  (via drill 1.02)
  other vias: 66.04,26.67
N$277  (via drill 1.02)
  other vias: 66.04,29.21
N$278  (via drill 1.02)
  other vias: 60.96,26.67
N$279  (via drill 1.02)
  other vias: 58.42,26.67
N$280  (via drill 1.02)
  other vias: 71.12,29.21
N$281  (via drill 1.02)
  other vias: 68.58,29.21
N$282  (via drill 1.02)
  other vias: 63.5,29.21
N$283  (via drill 1.02)
  other vias: 63.5,26.67
N$284  (via drill 1.02)
  other vias: 60.96,29.21
N$285  (via drill 1.02)
  other vias: 58.42,29.21
N$286  (via drill 1.02)
  other vias: 71.12,31.75
N$287  (via drill 1.02)
  other vias: 68.58,31.75
N$288  (via drill 1.02)
  other vias: 66.04,31.75
N$289  (via drill 1.02)
  other vias: 63.5,31.75
N$290  (via drill 1.02)
  other vias: 60.96,31.75
N$291  (via drill 1.02)
  other vias: 58.42,31.75
N$292  (via drill 1.02)
  other vias: 71.12,34.29
N$293  (via drill 1.02)
  other vias: 68.58,34.29
N$294  (via drill 1.02)
  other vias: 66.04,34.29
N$295  (via drill 1.02)
  other vias: 63.5,34.29
N$296  (via drill 1.02)
  other vias: 60.96,34.29
N$297  (via drill 1.02)
  other vias: 58.42,34.29
N$298  (via drill 1.02)
  other vias: 73.66,13.97
N$299  (via drill 1.02)
  other vias: 73.66,16.51
N$300  (via drill 1.02)
  other vias: 73.66,19.05
N$301  (via drill 1.02)
  other vias: 73.66,21.59
N$302  (via drill 1.02)
  other vias: 73.66,24.13
N$303  (via drill 1.02)
  other vias: 73.66,26.67
N$304  (via drill 1.02)
  other vias: 73.66,29.21
N$305  (via drill 1.02)
  other vias: 73.66,31.75
N$306  (via drill 1.02)
  other vias: 73.66,34.29
N$307  (via drill 1.02)
  other vias: 76.2,13.97
N$308  (via drill 1.02)
  other vias: 76.2,16.51
N$309  (via drill 1.02)
  other vias: 76.2,19.05
N$310  (via drill 1.02)
  other vias: 76.2,21.59
N$311  (via drill 1.02)
  other vias: 76.2,24.13
N$312  (via drill 1.02)
  other vias: 76.2,26.67
N$313  (via drill 1.02)
  other vias: 76.2,29.21
N$314  (via drill 1.02)
  other vias: 76.2,31.75
N$315  (via drill 1.02)
  other vias: 76.2,34.29
N$316  (via drill 1.02)
  other vias: 50.8,36.83
N$317  (via drill 1.02)
  other vias: 48.26,36.83
N$318  (via drill 1.02)
  other vias: 53.34,36.83
N$319  (via drill 1.02)
  other vias: 55.88,36.83
N$320  (via drill 1.02)
  other vias: 55.88,39.37
N$321  (via drill 1.02)
  other vias: 71.12,36.83
N$322  (via drill 1.02)
  other vias: 68.58,36.83
N$323  (via drill 1.02)
  other vias: 66.04,36.83
N$324  (via drill 1.02)
  other vias: 63.5,36.83
N$325  (via drill 1.02)
  other vias: 60.96,36.83
N$326  (via drill 1.02)
  other vias: 58.42,36.83
N$327  (via drill 1.02)
  other vias: 71.12,39.37
N$328  (via drill 1.02)
  other vias: 68.58,39.37
N$329  (via drill 1.02)
  other vias: 66.04,39.37
N$330  (via drill 1.02)
  other vias: 63.5,39.37
N$331  (via drill 1.02)
  other vias: 60.96,39.37
N$332  (via drill 1.02)
  other vias: 58.42,39.37
N$333  (via drill 1.02)
  other vias: 73.66,36.83
N$334  (via drill 1.02)
  other vias: 73.66,39.37
N$335  (via drill 1.02)
  other vias: 76.2,36.83
N$336  (via drill 1.02)
  other vias: 76.2,39.37
N$337
  Bottom 0.406: JP4.1 81.28,46.99 83.82,46.99 JP7.1
N$338
  Top 0.406: JP7.2 86.36,46.99 83.82,46.99 JP4.2
N$339
  Bottom 0.406: JP5.1 81.28,44.45 83.82,44.45 JP8.1
N$340
  Top 0.406: JP8.2 86.36,44.45 83.82,44.45 JP5.2
N$341
  Bottom 0.406: JP6.1 81.28,41.91 83.82,41.91 JP9.1
N$342
  Top 0.406: JP9.2 86.36,41.91 83.82,41.91 JP6.2
N$343
  Bottom 0.406: JP12.1 81.28,36.83 83.82,36.83 JP15.1
N$344
  Top 0.406: JP15.2 86.36,36.83 83.82,36.83 JP12.2
N$345
  Bottom 0.406: JP13.1 81.28,34.29 83.82,34.29 JP16.1
N$346
  Top 0.406: JP13.2 83.82,34.29 86.36,34.29 JP16.2
N$347
  Bottom 0.406: JP14.1 81.28,31.75 83.82,31.75 JP17.1
N$348
  Top 0.406: JP17.2 86.36,31.75 83.82,31.75 JP14.2
N$349
  Bottom 0.406: JP20.1 81.28,26.67 83.82,26.67 JP23.1
N$350
  Top 0.406: JP23.2 86.36,26.67 83.82,26.67 JP20.2
N$351
  Bottom 0.406: JP21.1 81.28,24.13 83.82,24.13 JP24.1
N$352
  Top 0.406: JP24.2 86.36,24.13 83.82,24.13 JP21.2
N$353
  Bottom 0.406: JP22.1 81.28,21.59 83.82,21.59 JP25.1
N$354
  Top 0.406: JP25.2 86.36,21.59 83.82,21.59 JP22.2
N$355
  Bottom 0.406: JP28.1 81.28,16.51 83.82,16.51 JP29.1
N$356
  Top 0.406: JP28.2 83.82,16.51 86.36,16.51 JP29.2
N$357
  Bottom 0.406: JP32.1 81.28,11.43 83.82,11.43 JP33.1
N$358
  Top 0.406: JP32.2 83.82,11.43 86.36,11.43 JP33.2
RESET
  Top 0.61: SLP.1 POWER.1 SLP.1 | SLP.1 24.13,8.89 23.5,9.53 8.66,9.53 S1.4 S1.3
VIN
  Top 0.61: POWER.6 SLP.6

### Text on the board
Bottom: (c) 2009 Marc Alexander
tPlace: Switch | 100nF | 5V | Tx3 | Rx3 | Tx2 | Rx2 | Tx1 | Rx1 | SDA | SCL | 10K | A | GND | D12 | D10 | D8 | D6 | D4 | D2 | D0 | 23 | REF | D13 | D11 | D9 | D7 | D5 | D3 | D1 | D14 | D15 | D16 | D17 | D18 | D19 | D20 | D21 | 25 | 5V | ON=LOW | 26 | 27 | 28 | 29 | 30 | 31 | 32 | 33 | 34 | 35 | 36 | 37 | 38 | 39 | 40 | 41 | 42 | 43 | 44 | 45 | 46 | 47 | ProtoShield v2.0 Mega | 48 | 49 | 50 | 51 | www.practicalarduino.com | 52 | 53 | GND | LOW | GND | Red | =ON | 3V3 | GND | VIN | A1 | A3 | A5 | A7 | A9 | A11 | A13 | A15 | RST | 5V | GND | A0 | A2 | A4 | A6 | A8 | A10 | A12 | A14 | Green | Reset | 1K | 1K | 100nF
bPlace: ON= | LOW | Tx3 | Rx3 | Tx2 | Rx2 | Tx1 | Rx1 | SDA | SCL | 23 | A | GND | D12 | D10 | D8 | D6 | D4 | D2 | D0 | 5V | Switch | REF | D13 | D11 | D9 | D7 | D5 | D3 | D1 | D14 | D15 | D16 | D17 | D18 | D19 | D20 | D21 | 25 | 26 | 27 | 28 | 29 | 30 | 31 | 32 | 33 | 34 | 35 | 36 | 37 | 38 | 39 | 40 | 41 | 42 | 43 | 44 | 45 | 46 | 47 | 48 | 49 | 50 | 51 | 52 | 53 | GND | Red | Green | 3V3 | GND | VIN | A1 | A3 | A5 | A7 | A9 | A11 | A13 | A15 | RST | 5V | GND | A0 | A2 | A4 | A6 | A8 | A10 | A12 | A14 | LOW | =ON